# Altium schematic sheet BM Output Stage.SchDoc
size A
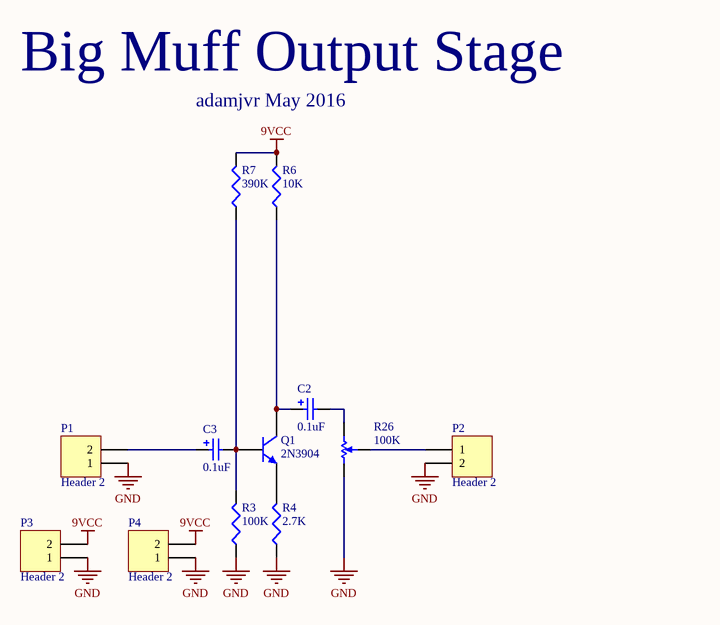
[diagram p0: BM Output Stage.SchDoc]

## Parts
C2  0.1uF  [5X12.5mmCAP]
C3  0.1uF  [5X12.5mmCAP]
P1  Header 2  [HDR1X2]
P2  Header 2  [HDR1X2]
P3  Header 2  [HDR1X2]
P4  Header 2  [HDR1X2]
Q1  2N3904  [TO-92A]
R3  100K  [R0805]
R4  2.7K  [R0805]
R6  10K  [R0805]
R7  390K  [R0805]
R26  100K  [BOURNS_PTD90SERIES_POT]

## Nets
9VCC: P3.2 P4.2 R6.2 R7.2
GND: P1.1 P2.2 P3.1 P4.1 R3.1 R4.1 R26.3
NetC2_1: C2.1 Q1.3(C) R6.1
NetC2_2: C2.2 R26.1
NetC3_1: C3.1 P1.2
NetC3_2: C3.2 Q1.2(B) R3.2 R7.1
NetP2_1: P2.1 R26.2
NetQ1_1: Q1.1(E) R4.2

## Notes on the sheet
- Big Muff Output Stage
- adamjvr May 2016

## Library data of the parts
C2 C3 = UFG2A0R1MDM1TD: CAP ALUM 0.1UF 20% 100V RADIAL; MFR: Nichicon; Pin Count #: 2; Type: Aluminum Capacitor Throughhole; Lead-Free ?: Yes; Designer: Adam Vadala-Roth; MFR #: UFG2A0R1MDM1TD; Status: Active; Mounting: SMT/SMD; Datasheet: http://nichicon-us.com/english/products/pdfs/e-ufg.pdf; Height: 12.5mm; Tolerance: 20%; Cost: 0.08413 @ @ 1000; Voltage: 100V; Date Created: 9 May 2016; Last Modified: 9 May 2016; Value: 0.1uF
P1-P4 = Header 2: Header, 2-Pin; LatestRevisionDate: 17-Jul-2002; LatestRevisionNote: Re-released for DXP Platform.; Publisher: Altium Limited
Q1 = 2N3904TF: TRANS NPN 40V 0.2A TO-92; MFR: Fairchild-Semiconductor; Pin Count #: 2; Type: NPN Transistor; Lead-Free ?: Yes; Designer: Adam Vadala-Roth; MFR #: 2N3904TF; Status: Active; Mounting: SMT/SMD; Datasheet: https://www.fairchildsemi.com/datasheets/MM/MMBT3904.pdf; Height: 5mm; Tolerance: N/A; Cost: 0.03468 @ 2000; Voltage: 40V; Date Created: 9 May 2016; Last Modified: 9 May 2016; Value: 2N3904
R3 = ERJ-6ENF1003V: RES SMD 100K OHM 1% 1/8W 0805; MFR: Panasonic-Electronic-Components; Pin Count #: 2; Lead-Free ?: Yes; Designer: Adam Vadala-Roth; MFR #: ERJ-6ENF1003V; Status: Active; Mounting: SMT/SMD; Datasheet: http://industrial.panasonic.com/www-cgi/jvcr13pz.cgi?E+PZ+3+AOA0002+ERJ6ENF1003V+7+WW; Height: 0.7mm; Tolerance: 1%; Cost: 0.00729 @ 1000; Type: Chip Resistor; Voltage: 1/8W; Date Created: 9 May 2016; Last Modified: 9 May 2016; Value: 100K
R4 = RC2012F272CS: RES SMD 2.7K OHM 1% 1/8W 0805; MFR: Samsung-Electro-Mechanics-America,-Inc.; Pin Count #: 2; Lead-Free ?: Yes; Designer: Adam Vadala-Roth; MFR #: RC2012F272CS; Status: Active; Mounting: SMT/SMD; Datasheet: https://media.digikey.com/pdf/Data%20Sheets/Samsung%20PDFs/RC_Series_ds.pdf; Height: 0.6mm; Tolerance: 1%; Cost: 0.004080 @ 1000; Type: Chip Resistor 0805; Voltage: 1/8W; Date Created: 8 May 2016; Last Modified: 8 May 2016; Value: 2.7K
R6 = ERJ-6ENF1002V: RES SMD 10K OHM 1% 1/8W 0805; MFR: Panasonic-Electronic-Components; Pin Count #: 2; Lead-Free ?: Yes; Designer: Adam Vadala-Roth; MFR #: ERJ-6ENF1002V; Status: Active; Mounting: SMT/SMD; Datasheet: http://industrial.panasonic.com/www-cgi/jvcr13pz.cgi?E+PZ+3+AOA0002+ERJ6ENF1002V+7+WW; Height: 0.7mm; Tolerance: 1%; Cost: 0.00729 @ 1000; Type: Chip Resistor 0805; Voltage: 1/8W; Date Created: 8 May 2016; Last Modified: 8 May 2016; Value: 10K
R7 = ERJ-6ENF3903V: RES SMD 390K OHM 1% 1/8W 0805; MFR: Panasonic-Electronic-Components; Pin Count #: 2; Lead-Free ?: Yes; Designer: Adam Vadala-Roth; MFR #: ERJ-6ENF3903V; Status: Active; Mounting: SMT/SMD; Datasheet: http://industrial.panasonic.com/www-cgi/jvcr13pz.cgi?E+PZ+3+AOA0002+ERJ6ENF3903V+7+WW; Height: 0.7mm; Tolerance: 1%; Cost: 0.00729 @ 1000; Type: Chip Resistor 0805; Voltage: 1/8W; Date Created: 8 May 2016; Last Modified: 8 May 2016; Value: 390K
R26 = PTD901-2015K-B104: POT 100K OHM 1/20W CARBON LINEAR; MFR: Bourns Inc.; Pin Count #: 3; Tolerance: 20%; Lead-Free ?: Yes; Designer: Adam Vadala-Roth; MFR #: PTD901-2015K-B104; Status: Active; Mounting: Through Hole; Datasheet: http://www.bourns.com/docs/Product-Datasheets/PTD90.pdf; Height: 11mm; Cost: 0.91800	 @ 1000; Type: Throughhole Potentiometer; Voltage: 1/20W; Date Created: 10 May 2016; Last Modified: 10 May 2016; Value: 100K